# Altium schematic sheet pushbutton.SchDoc
size A; SheetNumber: 6; SheetTotal: 13
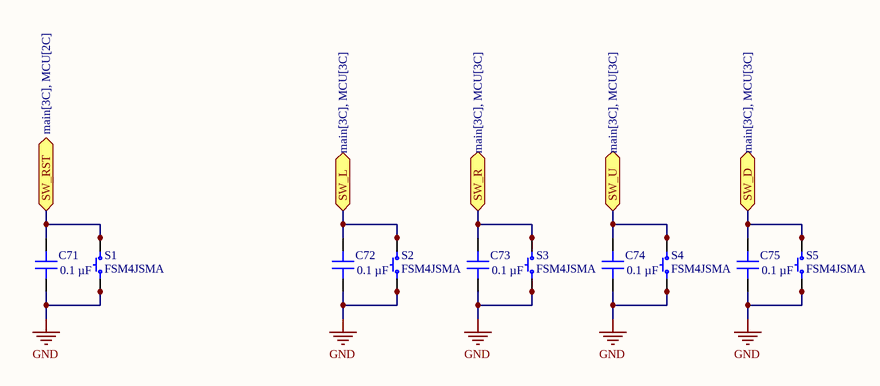
[diagram p0: pushbutton.SchDoc]

## Parts
C71  0.1 µF  [CAP 1206_3216 - 0.8MM]
C72  0.1 µF  [CAP 1206_3216 - 0.8MM]
C73  0.1 µF  [CAP 1206_3216 - 0.8MM]
C74  0.1 µF  [CAP 1206_3216 - 0.8MM]
C75  0.1 µF  [CAP 1206_3216 - 0.8MM]
S1  FSM4JSMA  [TE FSM4JSMA]
S2  FSM4JSMA  [TE FSM4JSMA]
S3  FSM4JSMA  [TE FSM4JSMA]
S4  FSM4JSMA  [TE FSM4JSMA]
S5  FSM4JSMA  [TE FSM4JSMA]

## Ports
SW_D (bidir, see main[3C], MCU[3C]), SW_L (bidir, see main[3C], MCU[3C]), SW_R (bidir, see main[3C], MCU[3C]), SW_RST (bidir, see main[3C], MCU[2C]), SW_U (bidir, see main[3C], MCU[3C])

## Nets
GND: C71.1 C72.1 C73.1 C74.1 C75.1 S1.1 S1.2 S2.1 S2.2 S3.1 S3.2 S4.1 S4.2 S5.1 S5.2
SW_D: C75.2 S5.3 S5.4 ; port SW_D
SW_L: C72.2 S2.3 S2.4 ; port SW_L
SW_R: C73.2 S3.3 S3.4 ; port SW_R
SW_RST: C71.2 S1.3 S1.4 ; port SW_RST
SW_U: C74.2 S4.3 S4.4 ; port SW_U

## Library data of the parts
C71-C75 = 885012208087: CAP CER 0.1UF 50V X7R 1206; manufacturer: Würth Elektronik; Tolerance: ±10%; Part Number: 885012208087; Capacitance: 0.1 µF; Applications: General Purpose; componentlink1description: Datasheet; componentlink1url: https://katalog.we-online.de/pbs/datasheet/885012208087.pdf; componentlink2description: DigiKey Link; componentlink2url: https://www.digikey.com/en/products/detail/würth-elektronik/885012208087/5453982; Device Package: 1206 (3216 Metric); lastupdated: 6/4/2024 19:10:27; Lifecycle Status: Active; Minimum Order: 1; Mounting Type: Surface Mount, MLCC; Operating Temperature: -55°C ~ 125°C; Package / Case: 1206 (3216 Metric); packaging: TapeAndReel; partid: 20879; Part Status: Active; price: 0.06; series: WCAP-CSGP; Size / Dimension: 0.126" L x 0.063" W (3.20mm x 1.60mm); Supplier 1: DigiKey; Supplier Part Number 1: 732-8127-1-ND; Temperature Coefficient: X7R; Thickness (Max): 0.035" (0.90mm); value: 0.1 µF; Voltage - Rated: 50V
S1-S5 = FSM4JSMA: SWITCH TACTILE SPST-NO 0.05A 24V; Manufacturer: TE Connectivity ALCOSWITCH Switches; Actuator Height off PCB, Vertical: 5.00mm; Actuator Orientation: Top Actuated; Actuator Type: Standard; Contact Rating @ Voltage: 0.05A @ 24VDC; Illumination: Non-Illuminated; Operating Force: 160gf; Outline: 6.00mm x 6.00mm; Switch Function: Off-Mom; Part Number: FSM4JSMA; Circuit: SPST-NO; ComponentLink1Description: Datasheet; ComponentLink1URL: https://www.te.com/commerce/DocumentDelivery/DDEController?Action=srchrtrv&DocNm=1308111-1_SWITCHES_CORE_PROGRAM_CATALOG&DocType=CS&DocLang=English; ComponentLink2Description: DigiKey Link; ComponentLink2URL: https://www.digikey.com/en/products/detail/te-connectivity-alcoswitch-switches/FSM4JSMA/525821; LastUpdated: 6/3/2024 20:19:31; Lifecycle Status: Active; Minimum Order: 1; Mounting Type: Surface Mount; Operating Temperature: -35°C ~ 85°C; Packaging: Bulk; Part Status: Active; Price: 0.14; Series: FSMJSMA; Supplier 1: DigiKey; Supplier Part Number 1: 450-1129-ND; Termination Style: Gull Wing